# EAGLE design fb_in_8_24V (EAGLE 5.00)
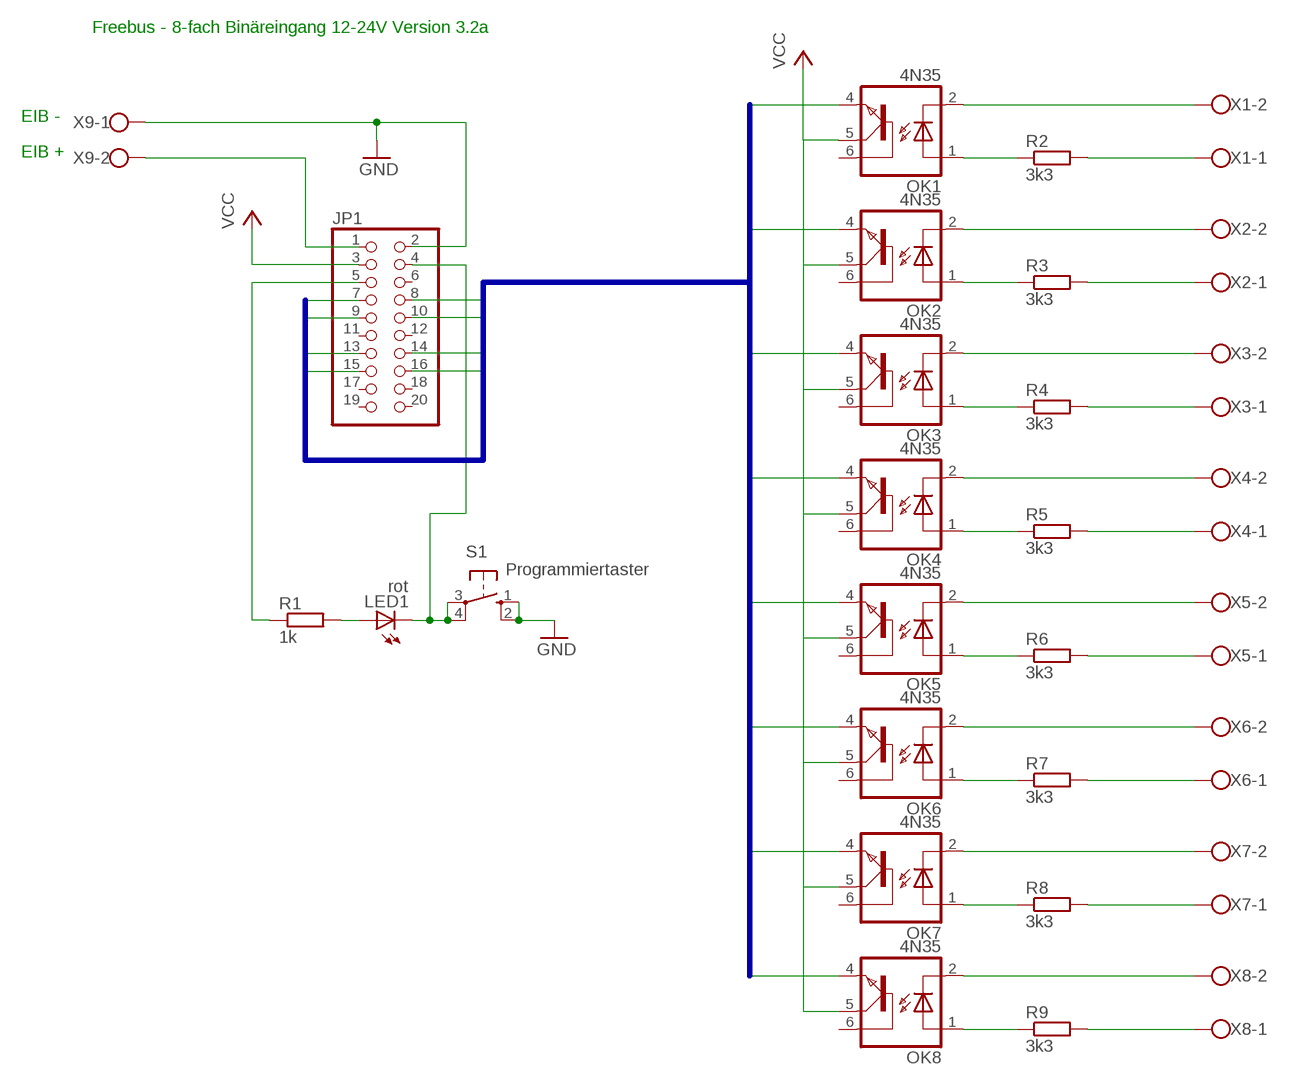
[diagram p0: schematic, sheet 1]

## Parts
JP1  PINHD-2X10  [2X10]
LED1  rot  LED3MM  [LED3MM]
OK1  4N35  [DIL06]
OK2  4N35  [DIL06]
OK3  4N35  [DIL06]
OK4  4N35  [DIL06]
OK5  4N35  [DIL06]
OK6  4N35  [DIL06]
OK7  4N35  [DIL06]
OK8  4N35  [DIL06]
R1  1k  R-EU_0207/10  [0207/10]
R2  3k3  R-EU_0207/10  [0207/10]
R3  3k3  R-EU_0207/10  [0207/10]
R4  3k3  R-EU_0207/10  [0207/10]
R5  3k3  R-EU_0207/10  [0207/10]
R6  3k3  R-EU_0207/10  [0207/10]
R7  3k3  R-EU_0207/10  [0207/10]
R8  3k3  R-EU_0207/10  [0207/10]
R9  3k3  R-EU_0207/10  [0207/10]
S1  Programmiertaster  10-XX  [B3F-10XX]
X1  W237-102  [W237-102]
X2  W237-102  [W237-102]
X3  W237-102  [W237-102]
X4  W237-102  [W237-102]
X5  W237-102  [W237-102]
X6  W237-102  [W237-102]
X7  W237-102  [W237-102]
X8  W237-102  [W237-102]
X9  W237-102  [W237-102]

## Nets
GND: JP1.2 S1.1(S) S1.2(S1) X9.1
IO1: JP1.7 OK1.4(EMI)
IO2: JP1.8 OK2.4(EMI)
IO3: JP1.9 OK3.4(EMI)
IO4: JP1.10 OK4.4(EMI)
IO5: JP1.13 OK5.4(EMI)
IO6: JP1.14 OK6.4(EMI)
IO7: JP1.15 OK7.4(EMI)
IO8: JP1.16 OK8.4(EMI)
N$1: R8.2 X7.1
N$2: JP1.4 LED1.K(C) S1.3(P) S1.4(P1)
N$3: LED1.A R1.2
N$4: JP1.5 R1.1
N$5: JP1.1 X9.2
N$25: OK2.2(C) X2.2
N$26: OK1.1(A) R2.1
N$27: OK2.1(A) R3.1
N$28: OK3.1(A) R4.1
N$29: OK4.1(A) R5.1
N$30: OK5.1(A) R6.1
N$31: OK6.1(A) R7.1
N$32: OK7.1(A) R8.1
N$33: OK8.1(A) R9.1
N$34: R3.2 X2.1
N$35: OK3.2(C) X3.2
N$36: R4.2 X3.1
N$37: OK4.2(C) X4.2
N$38: R5.2 X4.1
N$39: OK5.2(C) X5.2
N$40: R6.2 X5.1
N$41: OK1.2(C) X1.2
N$42: OK6.2(C) X6.2
N$43: R7.2 X6.1
N$44: OK7.2(C) X7.2
N$46: OK8.2(C) X8.2
N$47: R9.2 X8.1
N$48: R2.2 X1.1
VCC: JP1.3 OK1.5(COL) OK2.5(COL) OK3.5(COL) OK4.5(COL) OK5.5(COL) OK6.5(COL) OK7.5(COL) OK8.5(COL)
Unconnected: JP1.6 JP1.11 JP1.12 JP1.17 JP1.18 JP1.19 JP1.20 OK1.6(BAS) OK2.6(BAS) OK3.6(BAS) OK4.6(BAS) OK5.6(BAS) OK6.6(BAS) OK7.6(BAS) OK8.6(BAS)

## Buses
IO[1..8]

## Notes on the sheet
- Freebus - 8-fach Binäreingang 12-24V Version 3.2a
- EIB -
- EIB +

## Library data of the parts
JP1 = pinhead:PINHD-2X10: PIN HEADER
LED1 = led:LED: LED OSRAM: - CHIPLED LG R971, LG N971, LY N971, LG Q971, LY Q971, LO R971, LY R971 LH N974, LH R974 LS Q976, LO Q976, LY Q976 LO Q996 - Hyper CHIPLED LW Q18S LB Q993, LB Q99A, LB R99A - SideLED LS A670, LO A670, LY A670, LG A670, LP A670 LB A673, LV A673, LT A673, LW A673 LH A674 LY A675 LS A676, LA A676, LO A676, LY A676, LW A676 LS A679, LY A679, LG A679 - Hyper Micro SIDELED® LS Y876, LA Y876, LO Y876, LY Y876 LT Y87S - SmartLED LW L88C, LW L88S LB L89C, LB L89S, LG L890 LS L89K, LO L89K, LY L89K LS L896, LA L896, LO L896, LY L896 - TOPLED LS T670, LO T670, LY T670, LG T670, LP T670 LSG T670, LSP T670, LSY T670, LOP T670, LYG T670 LG T671, LOG T671, LSG T671 LB T673, LV T673, LT T673, LW T673 LH T674 LS T676, LA T676, LO T676, LY T676, LB T676, LH T676, LSB T676, LW T676 LB T67C, LV T67C, LT T67C, LS T67K, LO T67K, LY T67K, LW E67C LS E67B, LA E67B, LO E67B, LY E67B, LB E67C, LV E67C, LT E67C LW T67C LS T679, LY T679, LG T679 LS T770, LO T770, LY T770, LG T770, LP T770 LB T773, LV T773, LT T773, LW T773 LH T774 LS E675, LA E675, LY E675, LS T675 LS T776, LA T776, LO T776, LY T776, LB T776 LHGB T686 LT T68C, LB T68C - Hyper Mini TOPLED® LB M676 - Mini TOPLED Santana® LG M470 LS M47K, LO M47K, LY M47K Source: http://www.osram.convergy.de - LUMILED® LXK2-PW12-R00, LXK2-PW12-S00, LXK2-PW14-U00, LXK2-PW14-V00 LXK2-PM12-R00, LXK2-PM12-S00, LXK2-PM14-U00 LXK2-PE12-Q00, LXK2-PE12-R00, LXK2-PE12-S00, LXK2-PE14-T00, LXK2-PE14-U00 LXK2-PB12-K00, LXK2-PB12-L00, LXK2-PB12-M00, LXK2-PB14-N00, LXK2-PB14-P00, LXK2-PB14-Q00 LXK2-PR12-L00, LXK2-PR12-M00, LXK2-PR14-Q00, LXK2-PR14-R00 LXK2-PD12-Q00, LXK2-PD12-R00, LXK2-PD12-S00 LXK2-PH12-R00, LXK2-PH12-S00 LXK2-PL12-P00, LXK2-PL12-Q00, LXK2-PL12-R00 Source: www.luxeon.com
OK1-OK8 = optocoupler:4N35: MOTOROLA OPTO COUPLER
R1-R9 = rcl:R-EU_: RESISTOR, European symbol
S1 = switch-omron:10-XX: OMRON SWITCH
X1-X9 = con-wago-500:W237-102: WAGO SCREW CLAMP

## Board
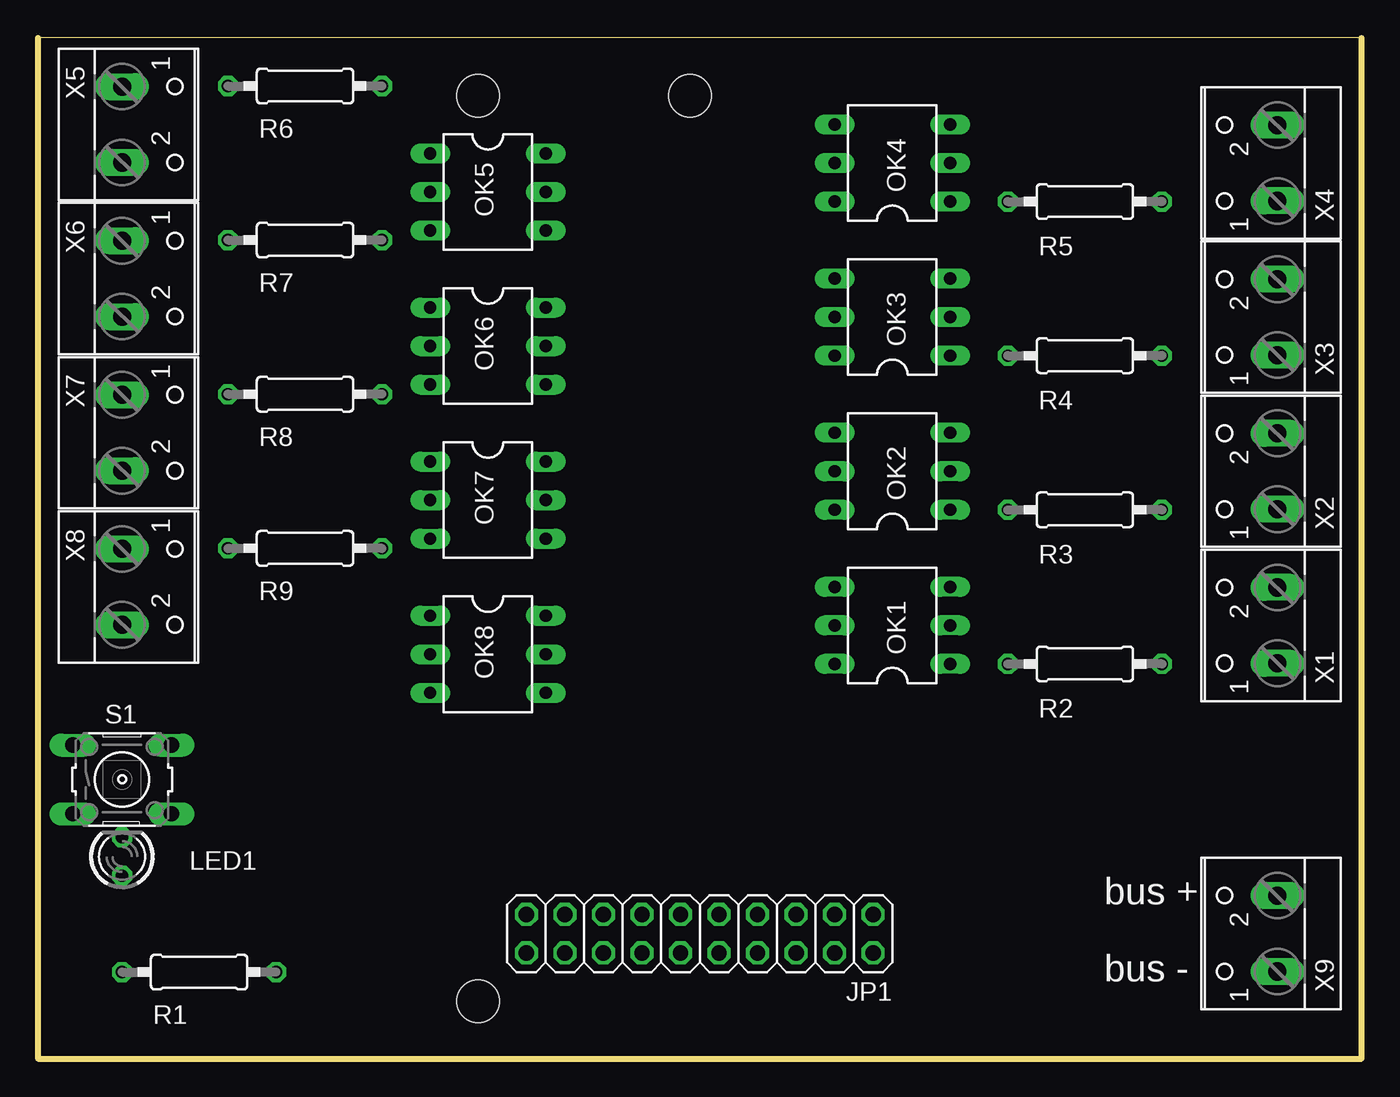
[diagram p1: board, top side]
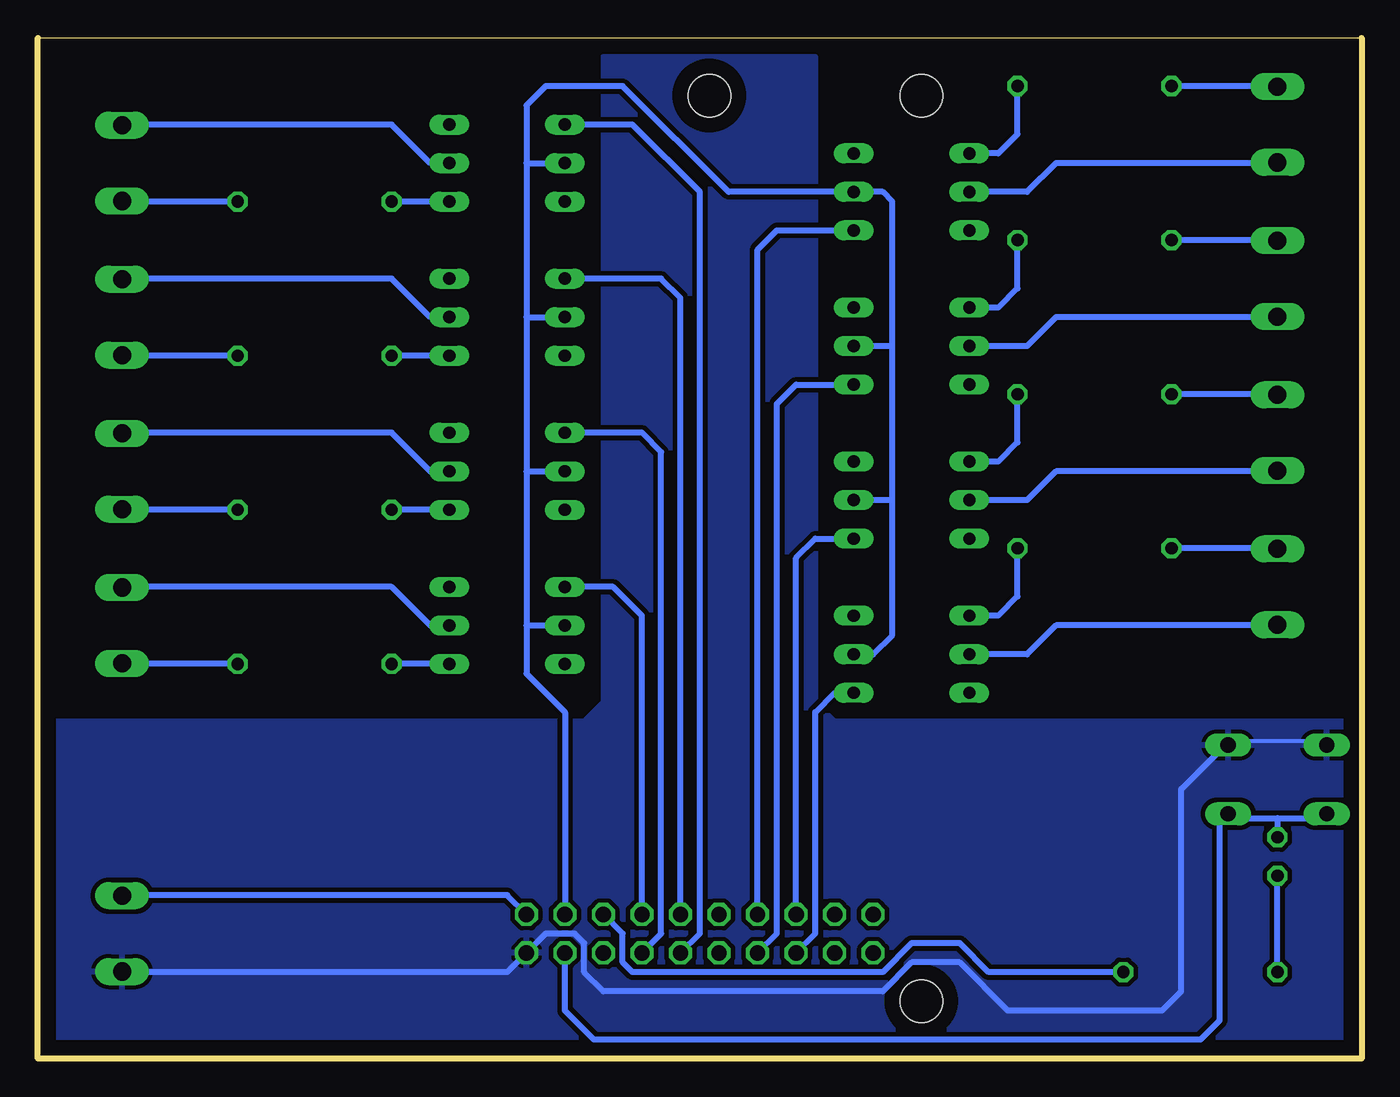
[diagram p2: board, bottom side, seen from below]

Size 87.3 x 67.3 mm. Coordinates in mm from the lower left corner, seen from the top.
Outline: 0,0 87.3,0 87.3,67.3 0,67.3 0,0
Copper layers (1*16): Top 0.035mm / dielectric 1.5mm / Bottom 0.035mm
Design rules "default *": minimum track width 10mil, minimum drill 24mil, track to track 12mil, track to pad 12mil, pad to pad 12mil, via to via 12mil, smd to smd 8mil, copper to edge 40mil, drill to drill 8mil, minimum pad ring 10mil, minimum via ring 8mil, stop-mask expansion 4mil, vias tented up to drill 0mil, thermal gap 10mil
Holes 2.8 mm at 43.02,63.5 29.04,3.8 29.04,63.5

### Footprints (pad centres in the part's own frame; a part is rotated, then mirrored left to right if it is on the bottom)
2X10 = drill 1.016 octagon: 1 -11.43,-1.27; 2 -11.43,1.27; 3 -8.89,-1.27; 4 -8.89,1.27; 5 -6.35,-1.27; 6 -6.35,1.27; 7 -3.81,-1.27; 8 -3.81,1.27; 9 -1.27,-1.27; 10 -1.27,1.27; 11 1.27,-1.27; 12 1.27,1.27; 13 3.81,-1.27; 14 3.81,1.27; 15 6.35,-1.27; 16 6.35,1.27; 17 8.89,-1.27; 18 8.89,1.27; 19 11.43,-1.27; 20 11.43,1.27
LED3MM = drill 0.813 octagon: A -1.27,0; K 1.27,0
DIL06 = drill 0.813 long: 1 -2.54,-3.81; 2 0,-3.81; 3 2.54,-3.81; 4 2.54,3.81; 5 0,3.81; 6 -2.54,3.81
0207/10 = drill 0.813 octagon: 1 -5.08,0; 2 5.08,0
B3F-10XX = drill 1.016 long: 1 -3.251,2.261; 2 3.251,2.261; 3 -3.251,-2.261; 4 3.251,-2.261
W237-102 = drill 1.194 long: 1 -2.5,-1.27; 2 2.5,-1.27

### Placement (x,y rotation side)
JP1  43.65,8.25 180 top
LED1  5.55,13.33 90 top
OK1  56.35,28.57 90 top
OK2  56.35,38.73 90 top
OK3  56.35,48.89 90 top
OK4  56.35,59.05 90 top
OK5  29.68,57.15 270 top
OK6  29.68,46.98 270 top
OK7  29.68,36.83 270 top
OK8  29.68,26.66 270 top
R1  10.63,5.71 180 top
R2  69.05,26.03 0 top
R3  69.05,36.19 0 top
R4  69.05,46.35 0 top
R5  69.05,56.51 0 top
R6  17.61,64.13 180 top
R7  17.61,53.97 180 top
R8  17.61,43.81 180 top
R9  17.61,33.65 180 top
S1  5.55,18.41 0 top
X1  80.48,28.57 90 top
X2  80.48,38.73 90 top
X3  80.48,48.89 90 top
X4  80.48,59.05 90 top
X5  6.82,61.59 270 top
X6  6.82,51.43 270 top
X7  6.82,41.27 270 top
X8  6.82,31.11 270 top
X9  80.48,8.25 90 top

### Tracks (layer width: path | path; a pad name or v marks a point on that pad's centre or on a via)
GND
  Bottom 0.254: S1.1 3.01,20.95 8.09,20.95 S1.2
  Bottom 0.406: 81.75,5.71 X9.1 80.48,5.71 56.35,5.71 JP1.2 53.81,8.25 51.91,8.25 51.27,7.62 51.27,5.71 50,4.44 31.58,4.44 29.68,6.34 26.5,6.34 23.33,3.17 13.17,3.17 11.9,4.44 11.9,17.77 8.8,20.87 | 8.8,20.87 8.73,20.95 | 8.8,20.87 S1.2
  pour Bottom: 0.47,0.63 0.47,22.22 34.76,22.22 36.03,23.49 36.03,66.67 50,66.67 50,23.49 51.27,22.22 86.83,22.22 86.83,0.63
IO1
  Bottom 0.406: JP1.7 47.46,29.2 49.37,31.11 OK1.4
IO2
  Bottom 0.406: JP1.8 46.19,8.25 46.19,40 47.46,41.27 OK2.4
IO3
  Bottom 0.406: JP1.9 44.92,50.16 46.19,51.43 OK3.4
IO4
  Bottom 0.406: JP1.10 43.65,8.25 43.65,57.15 48.09,61.59 OK4.4
IO5
  Bottom 0.406: JP1.13 39.84,53.34 38.57,54.61 OK5.4
IO6
  Bottom 0.406: JP1.14 38.57,8.25 38.57,43.18 37.3,44.45 OK6.4
IO7
  Bottom 0.406: JP1.15 37.3,33.02 36.03,34.29 OK7.4
IO8
  Bottom 0.406: JP1.16 36.03,8.25 36.03,22.86 34.76,24.12 OK8.4
N$1
  Bottom 0.406: R8.2 6.82,43.81 X7.1
N$2
  Bottom 0.406: JP1.4 52.54,3.17 50.63,1.27 10.63,1.27 9.36,2.54 9.36,15.87 S1.4 8.09,15.87 5.55,15.87 | 5.55,15.87 3.01,15.87 S1.3 | 5.55,15.87 LED1.K
N$3
  Bottom 0.406: R1.2 LED1.A
N$4
  Bottom 0.406: JP1.5 48.73,8.25 48.73,6.34 48.09,5.71 31.58,5.71 29.68,7.62 26.5,7.62 24.6,5.71 R1.1
N$5
  Bottom 0.406: JP1.1 56.35,10.79 80.48,10.79 X9.2
N$6
  pour Bottom: 0.47,0.63 0.47,22.22 34.76,22.22 36.03,23.49 36.03,66.03 50,66.03 50,23.49 51.27,22.22 86.83,22.22 86.83,0.63
N$25
  Bottom 0.406: OK2.2 61.43,38.73 63.97,41.27 80.48,41.27 X2.2
N$26
  Bottom 0.406: OK1.1 R2.1
N$27
  Bottom 0.406: OK2.1 R3.1
N$28
  Bottom 0.406: OK3.1 R4.1
N$29
  Bottom 0.406: OK4.1 R5.1
N$30
  Bottom 0.406: R6.1 22.7,60.96 23.96,59.69 OK5.1
N$31
  Bottom 0.406: R7.1 22.7,50.8 23.96,49.53 OK6.1
N$32
  Bottom 0.406: R8.1 22.7,40.64 23.96,39.37 OK7.1
N$33
  Bottom 0.406: R9.1 22.7,30.47 23.96,29.2 OK8.1
N$34
  Bottom 0.406: R3.2 80.48,36.19 X2.1
N$35
  Bottom 0.406: OK3.2 61.43,48.89 63.97,51.43 80.48,51.43 X3.2
N$36
  Bottom 0.406: R4.2 80.48,46.35 X3.1
N$37
  Bottom 0.406: OK4.2 61.43,59.05 63.97,61.59 80.48,61.59 X4.2
N$38
  Bottom 0.406: R5.2 80.48,56.51 X4.1
N$39
  Bottom 0.406: OK5.2 22.06,57.15 20.15,59.05 6.82,59.05 X5.2
N$40
  Bottom 0.406: R6.2 6.82,64.13 X5.1
N$41
  Bottom 0.406: OK1.2 61.43,28.57 63.97,31.11 80.48,31.11 X1.2
N$42
  Bottom 0.406: OK6.2 22.06,46.98 20.15,48.89 6.82,48.89 X6.2
N$43
  Bottom 0.406: R7.2 6.82,53.97 X6.1
N$44
  Bottom 0.406: OK7.2 22.06,36.83 20.15,38.73 6.82,38.73 X7.2
N$46
  Bottom 0.406: OK8.2 22.06,26.66 20.15,28.57 6.82,28.57 X8.2
N$47
  Bottom 0.406: R9.2 6.82,33.65 X8.1
N$48
  Bottom 0.406: R2.2 80.48,26.03 X1.1
VCC
  Bottom 0.406: OK8.5 32.22,26.66 30.95,27.93 30.95,36.83 | 30.95,36.83 OK7.5 | 30.95,36.83 30.95,46.98 | 30.95,46.98 OK6.5 | 30.95,46.98 30.95,56.51 31.58,57.15 OK5.5 41.74,57.15 48.73,64.13 53.81,64.13 55.08,62.86 55.08,59.05 | 55.08,59.05 OK4.5 | 55.08,59.05 55.08,48.89 | 55.08,48.89 OK3.5 | 55.08,48.89 55.08,38.73 | 55.08,38.73 OK2.5 | 55.08,38.73 55.08,28.57 | 55.08,28.57 OK1.5 | 55.08,28.57 55.08,25.39 52.54,22.86 JP1.3

### Text on the board
tPlace: bus + | bus -